# EAGLE schematic untitled (EAGLE 7.5.0)
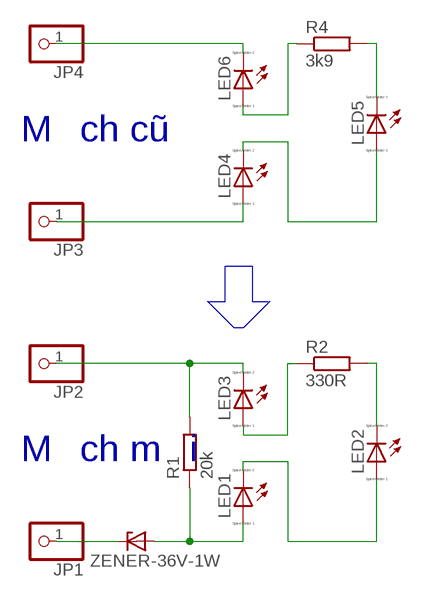
[diagram p0: schematic, sheet 1]

## Parts
JP1  PINHD-1X1  [1X01]
JP2  PINHD-1X1  [1X01]
JP3  PINHD-1X1  [1X01]
JP4  PINHD-1X1  [1X01]
LED1  LED_E  [LED_1206]
LED2  LED_E  [LED_1206]
LED3  LED_E  [LED_1206]
LED4  LED_E  [LED_1206]
LED5  LED_E  [LED_1206]
LED6  LED_E  [LED_1206]
R1  20k  R-EU_0204/7  [0204/7]
R2  330R  R-EU_0204/7  [0204/7]
R4  3k9  R-EU_0204/7  [0204/7]
ZENER-36V-1W  1N4728  [DO41Z10]

## Nets
N$1: LED1.A R1.1 ZENER-36V-1W.A
N$2: LED1.C LED2.A
N$3: LED2.C R2.2
N$4: JP2.1 LED3.C R1.2
N$5: LED3.A R2.1
N$6: JP1.1 ZENER-36V-1W.C
N$7: JP3.1 LED4.A
N$9: LED4.C LED5.A
N$10: LED5.C R4.2
N$11: LED6.A R4.1
N$12: JP4.1 LED6.C

## Buses
B$1

## Notes on the sheet
- Mạch cũ
- Mạch mới

## Library data of the parts
JP1-JP4 = pinhead:PINHD-1X1: PIN HEADER
LED1-LED6 = eagle-ltspice:LED_E: LED Source: http://www.osram.convergy.de Source: www.luxeon.com Source: www.kingbright.com; SPICEMODEL: NONE; SPICEPREFIX: D; SPICETYPE: diode
R1 R2 R4 = rcl:R-EU_: RESISTOR, European symbol
ZENER-36V-1W = diode:1N4728: Z DIODE 3.3 V, 1W, 5 percent